# EAGLE design ospi_v143+ (EAGLE 6.5.0)
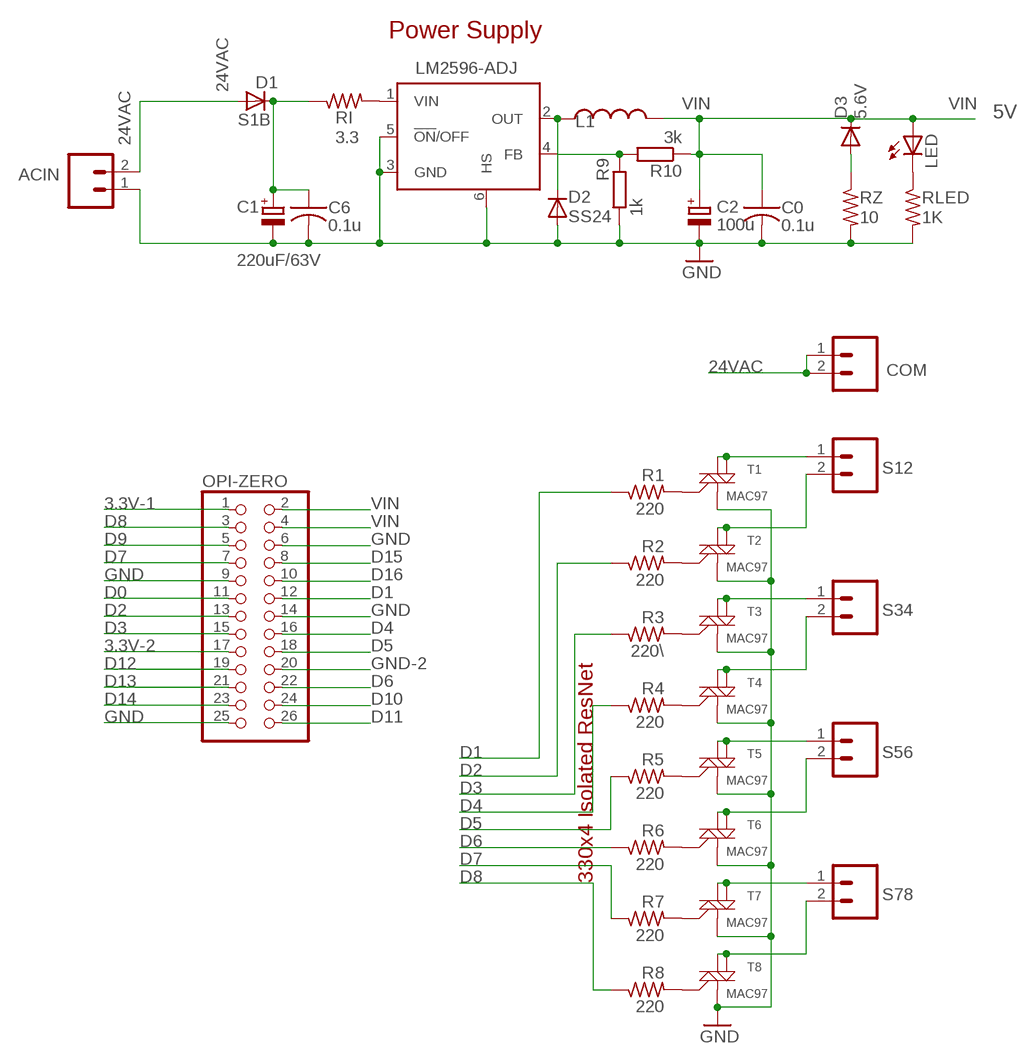
[diagram p0: schematic, sheet 1]

## Parts
ACIN  M025MM-X  [SCREWTERMINAL-5MM-2-X]
C0  0.1u  C-USC1206  [C1206]
C1  220uF/63V  CPOL-EUE  [PANASONIC_E]
C2  100u  CPOL-EUE  [PANASONIC_E]
C6  0.1u  C-USC1206  [C1206]
COM  M025MM-X  [SCREWTERMINAL-5MM-2-X]
D1  S1B  DIODE-DO-214AC  [DO-214AC]
D2  SS24  DIODE-SMB  [SMB]
D3  5.6V  DIODE-MINIMELF  [MINIMELF]
L1  150uH  INDUCTORPWR  [CDRH125]
LED  LEDCHIPLED_0805  [CHIPLED_0805]
LM2596-ADJ  LM2596-ADJ  LM2596S  [TO263-5]
OPI-ZERO  PINHD-2X13  [2X13]
R1  220  R-US_R0603  [R0603]
R2  220  R-US_R0603  [R0603]
R3  220\  R-US_R0603  [R0603]
R4  220  R-US_R0603  [R0603]
R5  220  R-US_R0603  [R0603]
R6  220  R-US_R0603  [R0603]
R7  220  R-US_R0603  [R0603]
R8  220  R-US_R0603  [R0603]
R9  1k  R-EU_M0805  [M0805]
R10  3k  R-EU_M0805  [M0805]
RI  3.3  R-US_R2010  [R2010]
RLED  1K  R-US_R1206  [R1206]
RZ  10  R-US_R2010  [R2010]
S12  M025MM-X  [SCREWTERMINAL-5MM-2-X]
S34  M025MM-X  [SCREWTERMINAL-5MM-2-X]
S56  M025MM-X  [SCREWTERMINAL-5MM-2-X]
S78  M025MM-X  [SCREWTERMINAL-5MM-2-X]
T1  MAC97  MAC97SOT223  [SOT223]
T2  MAC97  MAC97SOT223  [SOT223]
T3  MAC97  MAC97SOT223  [SOT223]
T4  MAC97  MAC97SOT223  [SOT223]
T5  MAC97  MAC97SOT223  [SOT223]
T6  MAC97  MAC97SOT223  [SOT223]
T7  MAC97  MAC97SOT223  [SOT223]
T8  MAC97  MAC97SOT223  [SOT223]

## Nets
3.3V-1: OPI-ZERO.1
3.3V-2: OPI-ZERO.17
24VAC [power]: ACIN.2 COM.1 COM.2 D1.A
D0: OPI-ZERO.11
D1: OPI-ZERO.12 R1.1
D2: OPI-ZERO.13 R2.1
D3: OPI-ZERO.15 R3.1
D4: OPI-ZERO.16 R4.1
D5: OPI-ZERO.18 R5.1
D6: OPI-ZERO.22 R6.1
D7: OPI-ZERO.7 R7.1
D8: OPI-ZERO.3 R8.1
D9: OPI-ZERO.5
D10: OPI-ZERO.24
D11: OPI-ZERO.26
D12: OPI-ZERO.19
D13: OPI-ZERO.21
D14: OPI-ZERO.23
D15: OPI-ZERO.8
D16: OPI-ZERO.10
GND [power]: ACIN.1 C0.2 C1.- C2.- C6.2 D2.A LM2596-ADJ.3(GND) LM2596-ADJ.5(!ON!/OFF) LM2596-ADJ.6(HS) OPI-ZERO.6 OPI-ZERO.9 OPI-ZERO.14 OPI-ZERO.25 R9.1 RLED.2 RZ.2 T1.1(M1) T2.1(M1) T3.1(M1) T4.1(M1) T5.1(M1) T6.1(M1) T7.1(M1) T8.1(M1)
GND-2 [power]: OPI-ZERO.20
N$1: LED.C RLED.1
N$2 [power]: C1.+ C6.1 D1.C RI.1
N$3: R1.2 T1.3(G)
N$4 [power]: LM2596-ADJ.4(FB) R9.2 R10.2
N$6: D3.A RZ.1
N$8 [power]: D2.C L1.1 LM2596-ADJ.2(OUT)
N$15: R2.2 T2.3(G)
N$16 [power]: S12.1 T1.2(M2) T1.4(M2-4)
N$17 [power]: S12.2 T2.2(M2) T2.4(M2-4)
N$18 [power]: S34.1 T3.2(M2) T3.4(M2-4)
N$19: R3.2 T3.3(G)
N$20 [power]: S34.2 T4.2(M2) T4.4(M2-4)
N$21: R4.2 T4.3(G)
N$22 [power]: S56.1 T5.2(M2) T5.4(M2-4)
N$23 [power]: S56.2 T6.2(M2) T6.4(M2-4)
N$24 [power]: S78.1 T7.2(M2) T7.4(M2-4)
N$25 [power]: S78.2 T8.2(M2) T8.4(M2-4)
N$26: R5.2 T5.3(G)
N$27: R6.2 T6.3(G)
N$28: R7.2 T7.3(G)
N$29: R8.2 T8.3(G)
N$57: LM2596-ADJ.1(VIN) RI.2
VIN [power]: C0.1 C2.+ D3.C L1.2 LED.A OPI-ZERO.2 OPI-ZERO.4 R10.1

## Notes on the sheet
- Power Supply
- 5V
- 330x4 Isolated ResNet

## Library data of the parts
ACIN COM S12 S34 S56 S78 = SparkFun:M02: Header 2 Standard 2-pin 0.1" header. Use with straight break away headers (SKU : PRT-00116), right angle break away headers (PRT-00553), swiss pins (PRT-00743), machine pins (PRT-00117), and female headers (PRT-00115). Molex polarized connector foot print use with SKU : PRT-08233 with associated crimp pins and housings.
C0 C6 = adafruit:C-US: CAPACITOR, American symbol
C1 C2 = resistor:CPOL-EU: POLARIZED CAPACITOR, European symbol
D1-D3 = diode:DIODE-: DIODE
L1 = SparkFunNew:INDUCTOR: Inductors Basic Inductor/Choke - 0603 and 1206. Footprints are not proven and vary greatly between part numbers.
LED = adafruit:LED: LED OSRAM: - CHIPLED LG R971, LG N971, LY N971, LG Q971, LY Q971, LO R971, LY R971 LH N974, LH R974 LS Q976, LO Q976, LY Q976 LO Q996 - Hyper CHIPLED LW Q18S LB Q993, LB Q99A, LB R99A - SideLED LS A670, LO A670, LY A670, LG A670, LP A670 LB A673, LV A673, LT A673, LW A673 LH A674 LY A675 LS A676, LA A676, LO A676, LY A676, LW A676 LS A679, LY A679, LG A679 - Hyper Micro SIDELED® LS Y876, LA Y876, LO Y876, LY Y876 LT Y87S - SmartLED LW L88C, LW L88S LB L89C, LB L89S, LG L890 LS L89K, LO L89K, LY L89K LS L896, LA L896, LO L896, LY L896 - TOPLED LS T670, LO T670, LY T670, LG T670, LP T670 LSG T670, LSP T670, LSY T670, LOP T670, LYG T670 LG T671, LOG T671, LSG T671 LB T673, LV T673, LT T673, LW T673 LH T674 LS T676, LA T676, LO T676, LY T676, LB T676, LH T676, LSB T676, LW T676 LB T67C, LV T67C, LT T67C, LS T67K, LO T67K, LY T67K, LW E67C LS E67B, LA E67B, LO E67B, LY E67B, LB E67C, LV E67C, LT E67C LW T67C LS T679, LY T679, LG T679 LS T770, LO T770, LY T770, LG T770, LP T770 LB T773, LV T773, LT T773, LW T773 LH T774 LS E675, LA E675, LY E675, LS T675 LS T776, LA T776, LO T776, LY T776, LB T776 LHGB T686 LT T68C, LB T68C - Hyper Mini TOPLED® LB M676 - Mini TOPLED Santana® LG M470 LS M47K, LO M47K, LY M47K Source: http://www.osram.convergy.de/
LM2596-ADJ = national-semiconductor:LM2596: SIMPLE SWITCHER® Power Converter 150 kHz 3A Step-Down Voltage Regulator Source: http://www.national.com/ds/LM/LM2596.pdf; MF: NATIONAL SEMICONDUCTOR; MPN: LM2596S-ADJ/NOPB; OC_FARNELL: 9494367; OC_NEWARK: 41K3842
OPI-ZERO = pinhead:PINHD-2X13: PIN HEADER
R1-R8 RLED RZ = adafruit2013:R-US_: RESISTOR, American symbol
R9 R10 = resistor:R-EU_: RESISTOR, European symbol
RI = adafruitGood:R-US_: RESISTOR, American symbol
T1-T8 = SparkFun:MAC97: MAC97 Triac http://www.onsemi.com/pub_link/Collateral/MAC97-D.PDF

## Net classes
0 default: width 0.178 mm, clearance 0.178 mm
1 power: width 0.406 mm, clearance 0.203 mm
2 relay power: width 0.508 mm, clearance 0.305 mm

## Board
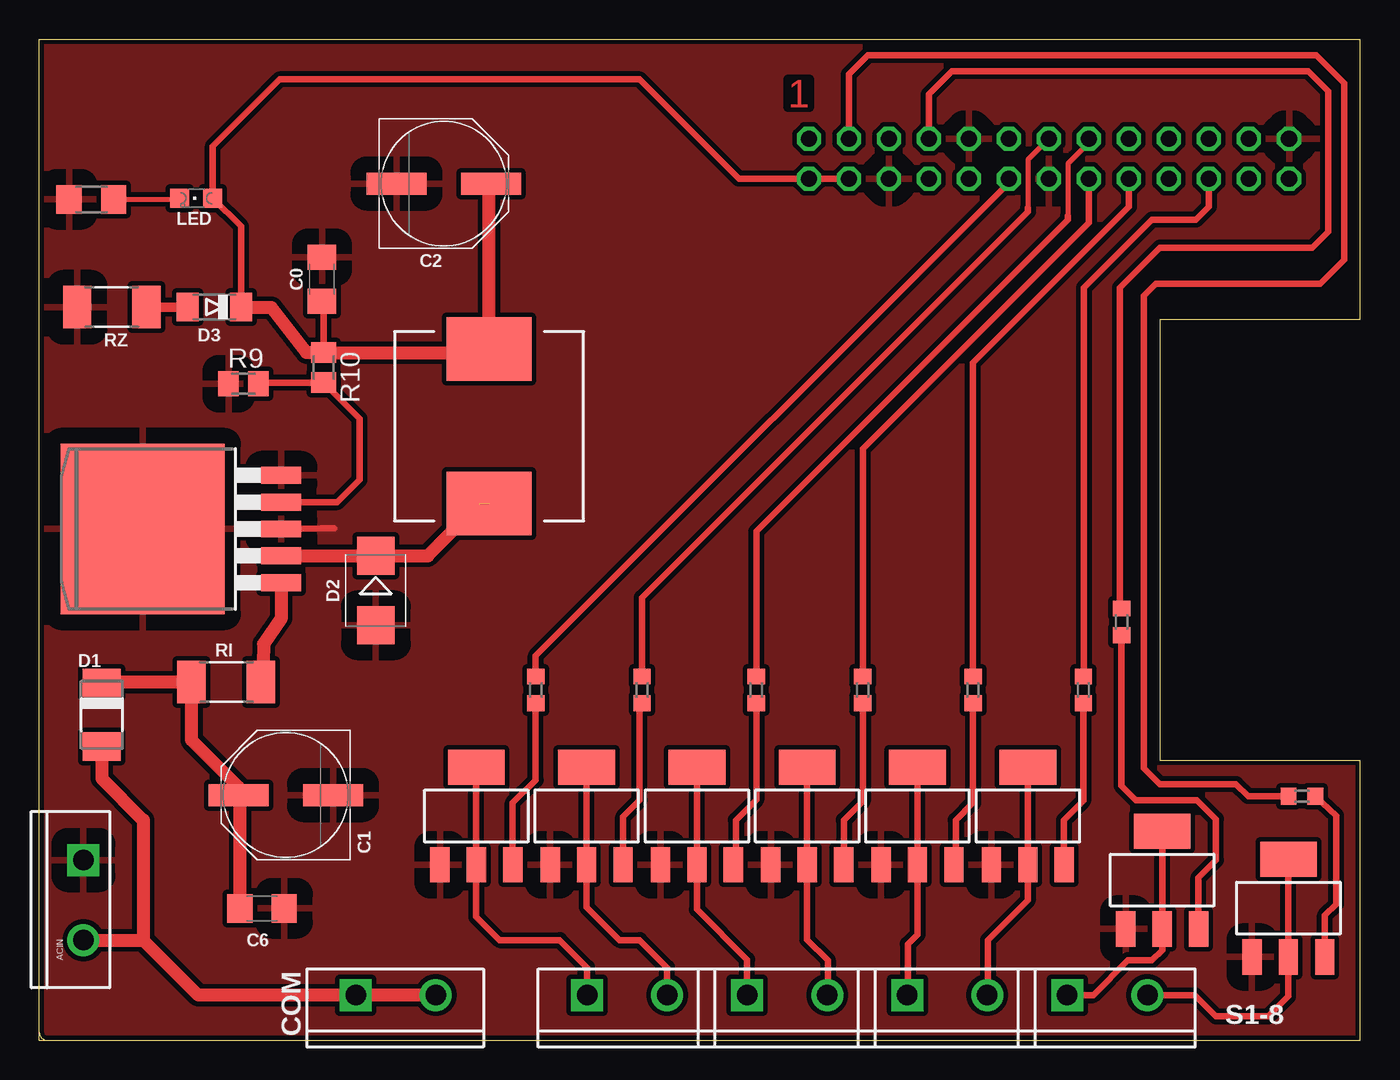
[diagram p1: board, top side]
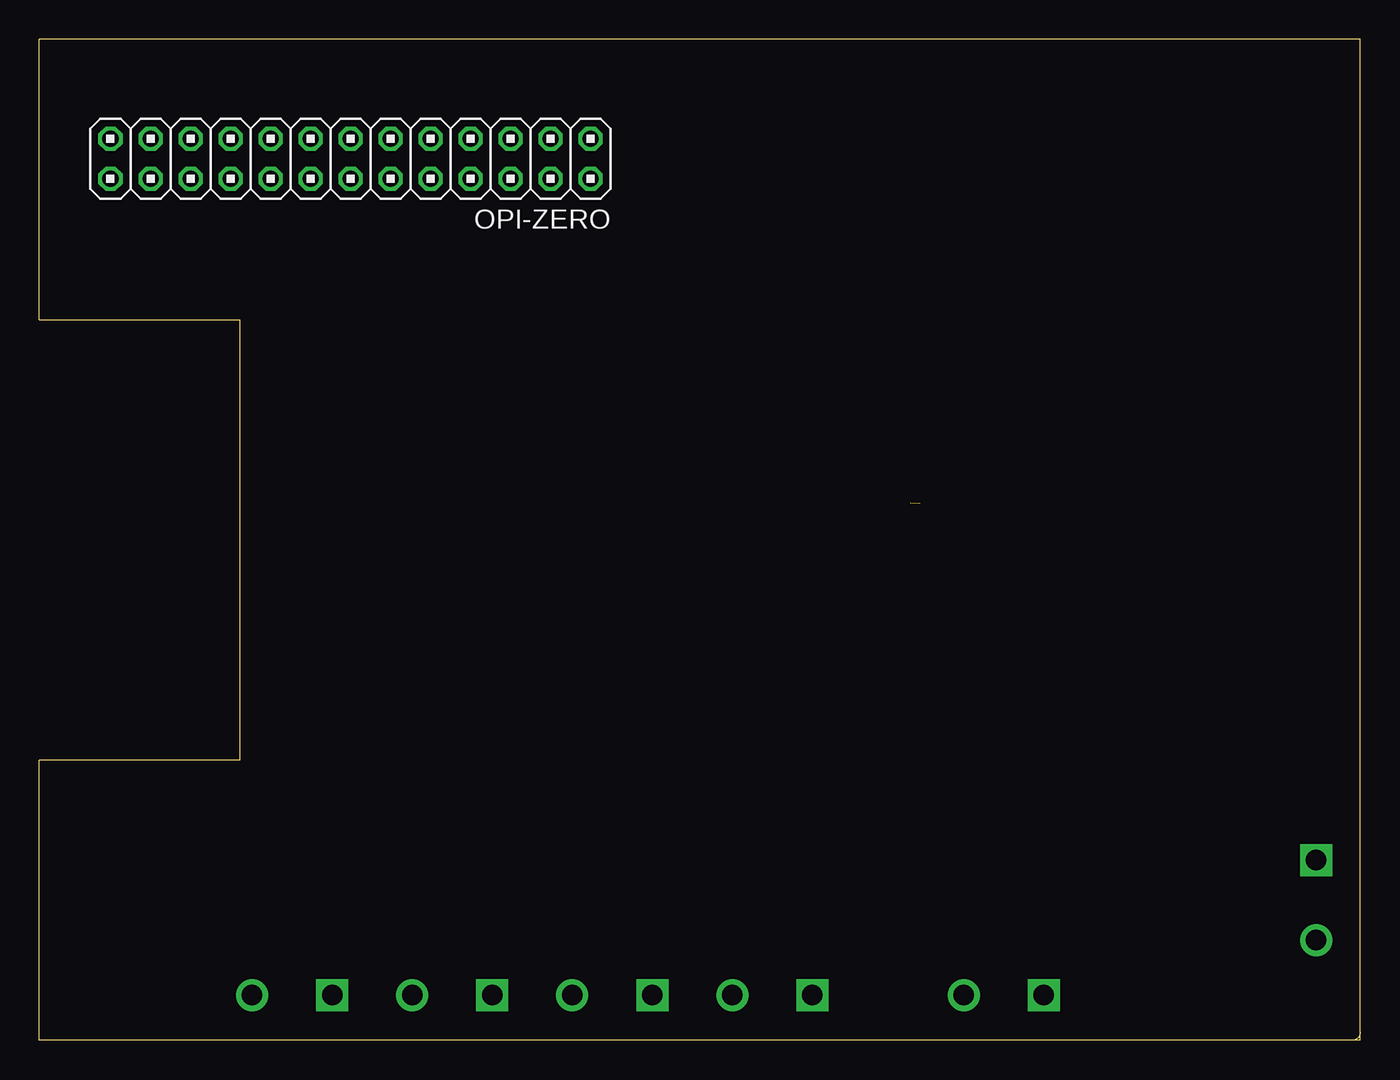
[diagram p2: board, bottom side, seen from below]

Size 83.82 x 63.5 mm. Coordinates in mm from the lower left corner, seen from the top.
Outline: 0,0.5 arc90 0.5,0
Outline: 0,0 83.82,0 83.82,17.78 71.12,17.78 71.12,45.72 83.82,45.72 83.82,63.5 0,63.5 0,0
Copper layers (1*16): Top 0.035mm / dielectric 1.5mm / Bottom 0.035mm
Design rules "Fusion_eagle_rule_v1.1 *": minimum track width 6mil, minimum drill 12mil, track to track 6mil, track to pad 6mil, pad to pad 6mil, via to via 6mil, smd to smd 0mil, copper to edge 10mil, drill to drill 10mil, minimum pad ring 10mil, minimum via ring 6mil, stop-mask expansion 2mil, vias tented up to drill 100mil, thermal gap 40mil

### Footprints (pad centres in the part's own frame; a part is rotated, then mirrored left to right if it is on the bottom)
SCREWTERMINAL-5MM-2-X = drill 1.3 pad 2.032 square: 1 0,0 | drill 1.3 pad 2.032: 2 5.08,0
C1206 = smd 1.6 x 1.8: 1 -1.4,0; 2 1.4,0
PANASONIC_E = smd 3.8 x 1.4: + 3,0; - -3,0
DO-214AC = smd 1.8 x 2.4: A 2.025,0; C -2.025,0
SMB = smd 2.4 x 2.4: A 2.2,0; C -2.2,0
MINIMELF = smd 1.4 x 1.8: A 1.7,0; C -1.7,0
CDRH125 = smd 5.4 x 4: 1 0,4.9; 2 0,-4.9
CHIPLED_0805 = smd 1.2 x 1.2: A 0,-1.05; C 0,1.05
TO263-5 = smd 1.067 x 2.54: 1 -3.404,-5.791; 2 -1.702,-5.791; 3 0,-5.791; 4 1.702,-5.791; 5 3.404,-5.791 | smd 10.8 x 10.41: 6 0,3
2X13 = drill 1.016 octagon: 1 -15.24,-1.27; 2 -15.24,1.27; 3 -12.7,-1.27; 4 -12.7,1.27; 5 -10.16,-1.27; 6 -10.16,1.27; 7 -7.62,-1.27; 8 -7.62,1.27; 9 -5.08,-1.27; 10 -5.08,1.27; 11 -2.54,-1.27; 12 -2.54,1.27; 13 0,-1.27; 14 0,1.27; 15 2.54,-1.27; 16 2.54,1.27; 17 5.08,-1.27; 18 5.08,1.27; 19 7.62,-1.27; 20 7.62,1.27; 21 10.16,-1.27; 22 10.16,1.27; 23 12.7,-1.27; 24 12.7,1.27; 25 15.24,-1.27; 26 15.24,1.27
R0603 = smd 1 x 1.1: 1 -0.85,0; 2 0.85,0
M0805 = smd 1.3 x 1.6: 1 -0.95,0; 2 0.95,0
R2010 = smd 1.8 x 2.7: 1 -2.2,0; 2 2.2,0
R1206 = smd 1.6 x 1.803: 1 -1.422,0; 2 1.422,0
SOT223 = smd 1.219 x 2.235: 1 -2.311,-3.099; 2 0,-3.099; 3 2.311,-3.099 | smd 3.6 x 2.2: 4 0,3.099

### Placement (x,y rotation side)
ACIN  2.79,11.43 270 top
C0  17.93,48.28 90 top
C1  15.64,15.56 180 top
C2  25.67,54.35 0 top
C6  14.13,8.37 0 top
COM  20.08,2.87 0 top
D1  3.96,20.66 270 top
D2  21.35,28.54 270 top
D3  11.1,46.52 180 top
L1  28.54,38.96 180 top
LED  9.95,53.43 90 top
LM2596-ADJ  9.56,32.44 90 top
OPI-ZERO  64.07,55.94 180 bottom
R1  31.5,22.23 270 top
R2  38.25,22.23 270 top
R3  45.5,22.23 270 top
R4  52.25,22.23 270 top
R5  59.25,22.23 270 top
R6  66.25,22.23 270 top
R7  68.68,26.55 270 top
R8  80.13,15.48 0 top
R9  12.95,41.66 0 top
R10  18.03,42.67 270 top
RI  11.86,22.73 0 top
RLED  3.3,53.35 180 top
RZ  4.6,46.52 180 top
S12  34.76,2.87 0 top
S34  44.92,2.87 0 top
S56  55.08,2.87 0 top
S78  65.24,2.87 0 top
T1  27.73,14.23 0 top
T2  34.73,14.23 0 top
T3  41.73,14.23 0 top
T4  48.73,14.23 0 top
T5  55.73,14.23 0 top
T6  62.73,14.23 0 top
T7  71.25,10.17 0 top
T8  79.27,8.39 0 top

### Tracks (layer width: path | path; a pad name or v marks a point on that pad's centre or on a via)
24VAC
  Top 0.813: COM.2 COM.1 10.08,2.87 6.6,6.35 | ACIN.2 6.6,6.35 | D1.A 3.96,16.61 6.6,13.97 6.6,6.35
D1
  Top 0.305: R1.1
  Top 0.406: R1.1 31.5,24.38 61.53,54.42 OPI-ZERO.12
D2
  Top 0.305: OPI-ZERO.13 62.74,55.88 62.74,52.83
  Top 0.406: R2.1 38.25,28.09 62.74,52.58 62.74,52.83
D3
  Top 0.305: OPI-ZERO.15 66.61,56.96 65.28,55.63 65.28,52.32
  Top 0.406: 65.28,52.32 65.28,52.07 45.5,32.29 R3.1
D4
  Top 0.406: OPI-ZERO.16 66.61,51.88 52.25,37.52 R4.1
D5
  Top 0.406: OPI-ZERO.18 69.15,52.89 64.01,47.75 63.25,46.99 59.25,43 R5.1
D6
  Top 0.406: OPI-ZERO.22 74.23,52.89 73.41,52.07 70.61,52.07 66.29,47.75 66.29,23.12 R6.1
D7
  Top 0.406: OPI-ZERO.7 56.45,60.01 57.91,61.47 80.52,61.47 81.79,60.2 81.79,51.31 80.77,50.29 71.12,50.29 68.58,47.75 68.58,27.5 R7.1
D8
  Top 0.406: OPI-ZERO.3 51.37,61.28 52.58,62.48 81.03,62.48 82.8,60.71 82.8,49.53 81.28,48.01 70.87,48.01 70.1,47.24 70.1,17.27 71.12,16.26 75.95,16.26 76.72,15.48 R8.1
GND
  Top 0.406: 18.72,32.5 17.92,32.5 LM2596-ADJ.3
  pour Top (isolate 0.305): 0,0 83.82,0 83.82,17.78 71.12,17.78 71.12,45.72 83.82,45.72 83.82,63.5 0,63.5
N$1
  Top 0.305: RLED.1 8.82,53.35 LED.C
N$2
  Top 0.813: C6.1 12.73,15.47 C1.+ 12.64,16.07 9.65,19.05 RI.1 4,22.73 D1.C
N$3
  Top 0.406: T1.3 30.04,15.05 31.5,16.51 R1.2
N$4
  Top 0.406: R9.2 13.97,41.72 R10.2 20.32,39.44 20.32,35.56 18.9,34.14 LM2596-ADJ.4
N$6
  Top 0.61: D3.A RZ.1
N$8  (1 unrouted)
  Top 0.813: LM2596-ADJ.2 D2.C 24.64,30.74 27.94,34.04
N$15
  Top 0.406: T2.3 37.04,14.18 38.1,15.24 38.1,21.23 R2.2
N$16
  Top 0.406: S12.1 34.76,4.61 33.02,6.35 29.21,6.35 27.73,7.83 T1.2 T1.4
N$17
  Top 0.406: S12.2 39.84,4.61 38.1,6.35 36.83,6.35 34.73,8.45 T2.2 T2.4
N$18
  Top 0.406: S34.1 44.92,5.12 41.73,8.31 T3.2 T3.4
N$19
  Top 0.406: R3.2 45.5,15.27 44.2,13.97 44.2,11.29 T3.3
N$20
  Top 0.406: S34.2 50.04,2.91 50.04,5.08 48.73,6.39 T4.2 T4.4
N$21
  Top 0.406: R4.2 52.25,15.17 51.05,13.97 51.05,11.14 T4.3
N$22
  Top 0.406: S56.1 55.12,2.91 55.12,6.1 55.73,6.71 T5.2 T5.4
N$23
  Top 0.406: S56.2 60.2,2.91 60.2,6.35 62.73,8.88 T6.2 T6.4
N$24
  Top 0.406: T7.2 T7.4 | S78.1 66.88,2.87 69.09,5.08 70.61,5.08 71.25,5.72 T7.2 | 71.37,7.71 T7.2
N$25
  Top 0.406: T8.4 T8.2 79.25,5.27 79.25,2.79 77.98,1.52 74.68,1.52 73.33,2.87 S78.2
N$26
  Top 0.406: R5.2 59.25,15.06 58.17,13.97 58.17,11.26 T5.3
N$27
  Top 0.406: R6.2 66.25,15.2 65.02,13.97 65.02,11.15 T6.3
N$28
  Top 0.406: T7.3 73.56,10.32 74.68,11.43 74.68,14.03 73.46,15.24 69.6,15.24 68.68,16.15 R7.2
N$29
  Top 0.406: T8.3 81.58,7.92 82.3,8.64 82.3,14.26 R8.2
N$57
  Top 0.813: LM2596-ADJ.1 15.35,26.78 14.22,25.15 14.18,22.61 RI.2
VIN
  Top 0.406: D3.C 12.8,51.63 LED.A 11,56.72 15.24,60.96 38.1,60.96 44.39,54.67 OPI-ZERO.2 OPI-ZERO.4 | R10.1 18.03,46.99 C0.1
  Top 0.813: C2.+ 28.54,54.23 L1.2 28.31,43.62 R10.1 16.95,43.62 14.73,46.48 12.84,46.48 D3.C

### Text on the board
Top: 1
tNames: S1-8